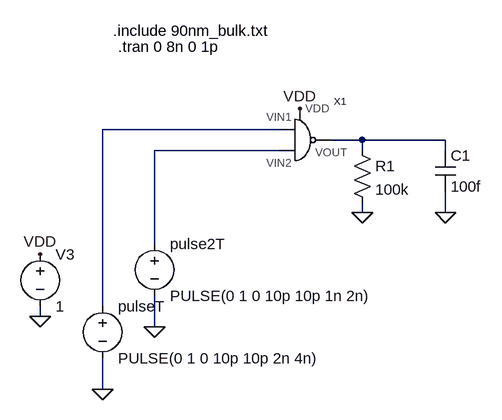
[diagram p0: schematic nand-tests.asc]
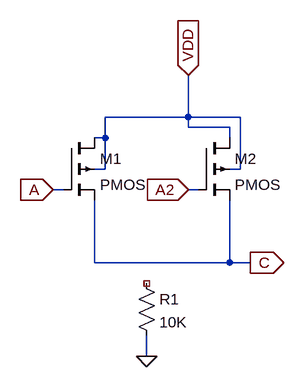
[diagram p1: sub-circuit nand.asc]
nand-tests.asc, the LTspice schematic file:
Version 4
SHEET 1 880 680
WIRE 384 208 112 208
WIRE 512 224 464 224
WIRE 640 224 512 224
WIRE 384 240 192 240
WIRE 512 240 512 224
WIRE 640 240 640 224
WIRE 512 336 512 320
WIRE 640 336 640 304
WIRE 192 384 192 240
WIRE 112 480 112 208
WIRE 16 496 16 480
WIRE 192 512 192 464
WIRE 112 608 112 560
FLAG 192 512 0
FLAG 112 608 0
FLAG 512 336 0
FLAG 640 336 0
FLAG 16 496 0
FLAG 16 400 VDD
FLAG 416 176 VDD
SYMBOL nand 416 224 R0
SYMATTR InstName X1
SYMBOL voltage 192 368 R0
WINDOW 123 0 0 Left 0
WINDOW 39 0 0 Left 0
SYMATTR InstName pulse2T
SYMATTR Value PULSE(0 1 0 10p 10p 1n 2n)
SYMBOL voltage 112 464 R0
WINDOW 123 0 0 Left 0
WINDOW 39 0 0 Left 0
SYMATTR InstName pulseT
SYMATTR Value PULSE(0 1 0 10p 10p 2n 4n)
SYMBOL cap 624 240 R0
SYMATTR InstName C1
SYMATTR Value 100f
SYMBOL res 496 224 R0
SYMATTR InstName R1
SYMATTR Value 100k
SYMBOL voltage 16 384 R0
WINDOW 123 0 0 Left 0
WINDOW 39 0 0 Left 0
SYMATTR InstName V3
SYMATTR Value 1
TEXT 128 56 Left 2 !.include 90nm_bulk.txt
TEXT 136 80 Left 2 !.tran 0 8n 0 1p

nand.asc, the sub-circuit schematic file:
Version 4
SHEET 1 880 680
WIRE 256 80 256 16
WIRE 256 80 128 80
WIRE 336 80 256 80
WIRE 256 96 256 80
WIRE 320 96 256 96
WIRE 128 112 128 80
WIRE 128 112 112 112
WIRE 320 112 320 96
WIRE 128 160 128 112
WIRE 128 160 112 160
WIRE 336 160 336 80
WIRE 336 160 320 160
WIRE 64 192 48 192
WIRE 272 192 256 192
WIRE 112 304 112 208
WIRE 320 304 112 304
WIRE 320 304 320 208
WIRE 352 304 320 304
WIRE 192 448 192 416
FLAG 48 192 A
IOPIN 48 192 In
FLAG 256 192 A2
IOPIN 256 192 In
FLAG 192 448 0
FLAG 352 304 C
IOPIN 352 304 Out
FLAG 256 16 VDD
IOPIN 256 16 In
SYMBOL pmos4 64 112 R0
SYMATTR InstName M1
SYMBOL pmos4 272 112 R0
SYMATTR InstName M2
SYMBOL res 176 320 R0
SYMATTR InstName R1
SYMATTR Value 10K

The netlist it stands for:
* nand-tests.asc
XX1 N001 N003 N002 VDD nand
V§pulse2T N003 0 PULSE(0 1 0 10p 10p 1n 2n)
V§pulseT N001 0 PULSE(0 1 0 10p 10p 2n 4n)
C1 N002 0 100f
R1 N002 0 100k
V3 VDD 0 1

* block symbol definitions
.subckt nand VIN1 VIN2 VOUT VDD
M1 VDD A C VDD PMOS
M2 VDD A2 C VDD PMOS
R1 NC_01 0 10K
.ends nand

.model NMOS NMOS
.model PMOS PMOS
.lib standard.mos
.include 90nm_bulk.txt
.tran 0 8n 0 1p
.backanno
.end